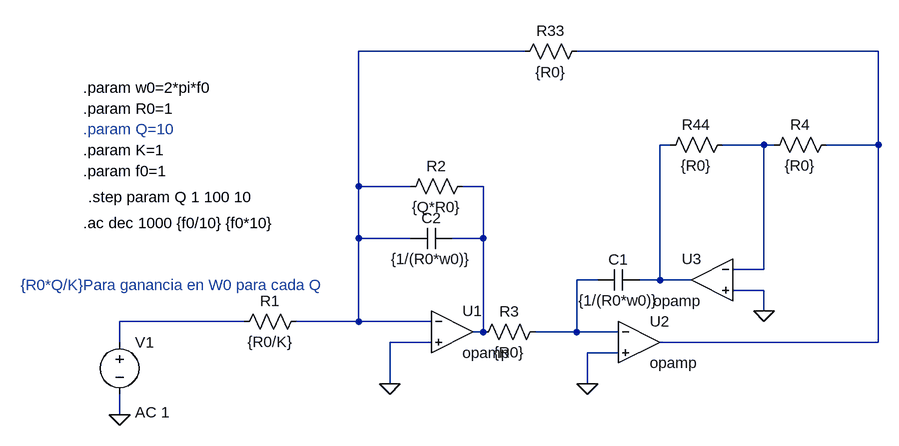
[diagram p0: schematic Semanal#2Bonus3.asc]
Semanal#2Bonus3.asc, the LTspice schematic file:
Version 4
SHEET 1 880 680
WIRE 176 -224 -80 -224
WIRE 720 -224 256 -224
WIRE 400 -80 384 -80
WIRE 544 -80 480 -80
WIRE 560 -80 544 -80
WIRE 720 -80 720 -224
WIRE 720 -80 640 -80
WIRE -80 -16 -80 -224
WIRE 0 -16 -80 -16
WIRE 112 -16 80 -16
WIRE -80 64 -80 -16
WIRE 0 64 -80 64
WIRE 112 64 112 -16
WIRE 112 64 64 64
WIRE 544 112 544 -80
WIRE 544 112 496 112
WIRE 288 128 256 128
WIRE 384 128 384 -80
WIRE 384 128 352 128
WIRE 432 128 384 128
WIRE 544 144 496 144
WIRE 544 176 544 144
WIRE -256 192 -448 192
WIRE -80 192 -80 64
WIRE -80 192 -176 192
WIRE 32 192 -80 192
WIRE 112 208 112 64
WIRE 112 208 96 208
WIRE 256 208 256 128
WIRE 256 208 192 208
WIRE 320 208 256 208
WIRE -448 224 -448 192
WIRE 32 224 -32 224
WIRE 720 224 720 -80
WIRE 720 224 384 224
WIRE 320 240 272 240
WIRE -32 288 -32 224
WIRE 272 288 272 240
WIRE -448 336 -448 304
FLAG 272 288 0
FLAG -32 288 0
FLAG 544 176 0
FLAG -448 336 0
SYMBOL opamp 64 144 R0
SYMATTR InstName U1
SYMBOL opamp 352 160 R0
SYMATTR InstName U2
SYMBOL opamp 464 64 M0
SYMATTR InstName U3
SYMBOL res 208 192 R90
WINDOW 0 0 56 VBottom 2
WINDOW 3 32 56 VTop 2
SYMATTR InstName R3
SYMATTR Value {R0}
SYMBOL cap 352 112 R90
WINDOW 0 0 32 VBottom 2
WINDOW 3 32 32 VTop 2
SYMATTR InstName C1
SYMATTR Value {1/(R0*w0)}
SYMBOL res 496 -96 R90
WINDOW 0 0 56 VBottom 2
WINDOW 3 32 56 VTop 2
SYMATTR InstName R44
SYMATTR Value {R0}
SYMBOL res 656 -96 R90
WINDOW 0 0 56 VBottom 2
WINDOW 3 32 56 VTop 2
SYMATTR InstName R4
SYMATTR Value {R0}
SYMBOL res 272 -240 R90
WINDOW 0 0 56 VBottom 2
WINDOW 3 32 56 VTop 2
SYMATTR InstName R33
SYMATTR Value {R0}
SYMBOL res -16 0 R270
WINDOW 0 32 56 VTop 2
WINDOW 3 0 56 VBottom 2
SYMATTR InstName R2
SYMATTR Value {Q*R0}
SYMBOL cap 64 48 R90
WINDOW 0 0 32 VBottom 2
WINDOW 3 32 32 VTop 2
SYMATTR InstName C2
SYMATTR Value {1/(R0*w0)}
SYMBOL res -160 176 R90
WINDOW 0 0 56 VBottom 2
WINDOW 3 32 56 VTop 2
SYMATTR InstName R1
SYMATTR Value {R0/K}
SYMBOL voltage -448 208 R0
WINDOW 123 24 124 Left 2
WINDOW 39 0 0 Left 0
SYMATTR InstName V1
SYMATTR Value ""
SYMATTR Value2 AC 1
TEXT -504 40 Left 2 !.ac dec 1000 {f0/10} {f0*10}
TEXT -496 0 Left 2 !.step param Q 1 100 10
TEXT -504 -136 Left 2 !.param R0=1
TEXT -504 -168 Left 2 !.param w0=2*pi*f0
TEXT -504 -104 Left 2 ;.param Q=10
TEXT -504 -72 Left 2 !.param K=1
TEXT -504 -40 Left 2 !.param f0=1
TEXT -600 136 Left 2 ;{R0*Q/K}Para ganancia en W0 para cada Q

The netlist it stands for:
* Semanal#2Bonus3.asc
XU1 N001 0 N005 opamp Aol=100K GBW=10Meg  ; pins invin noninvin out
XU2 N006 0 N002 opamp Aol=100K GBW=10Meg  ; pins invin noninvin out
XU3 N004 0 N003 opamp Aol=100K GBW=10Meg  ; pins invin noninvin out
R3 N006 N005 {R0}
C1 N003 N006 {1/(R0*w0)}
R44 N004 N003 {R0}
R4 N002 N004 {R0}
R33 N002 N001 {R0}
R2 N001 N005 {Q*R0}
C2 N005 N001 {1/(R0*w0)}
R1 N001 N007 {R0/K}
V1 N007 0 AC 1
.ac dec 1000 {f0/10} {f0*10}
.step param Q 1 100 10
.param R0=1
.param w0=2*pi*f0
* .param Q=10
.param K=1
.param f0=1
* {R0*Q/K}Para ganancia en W0 para cada Q
.backanno
.end